# EAGLE design Lazerade_ChevronMCU (EAGLE 8.5.1)
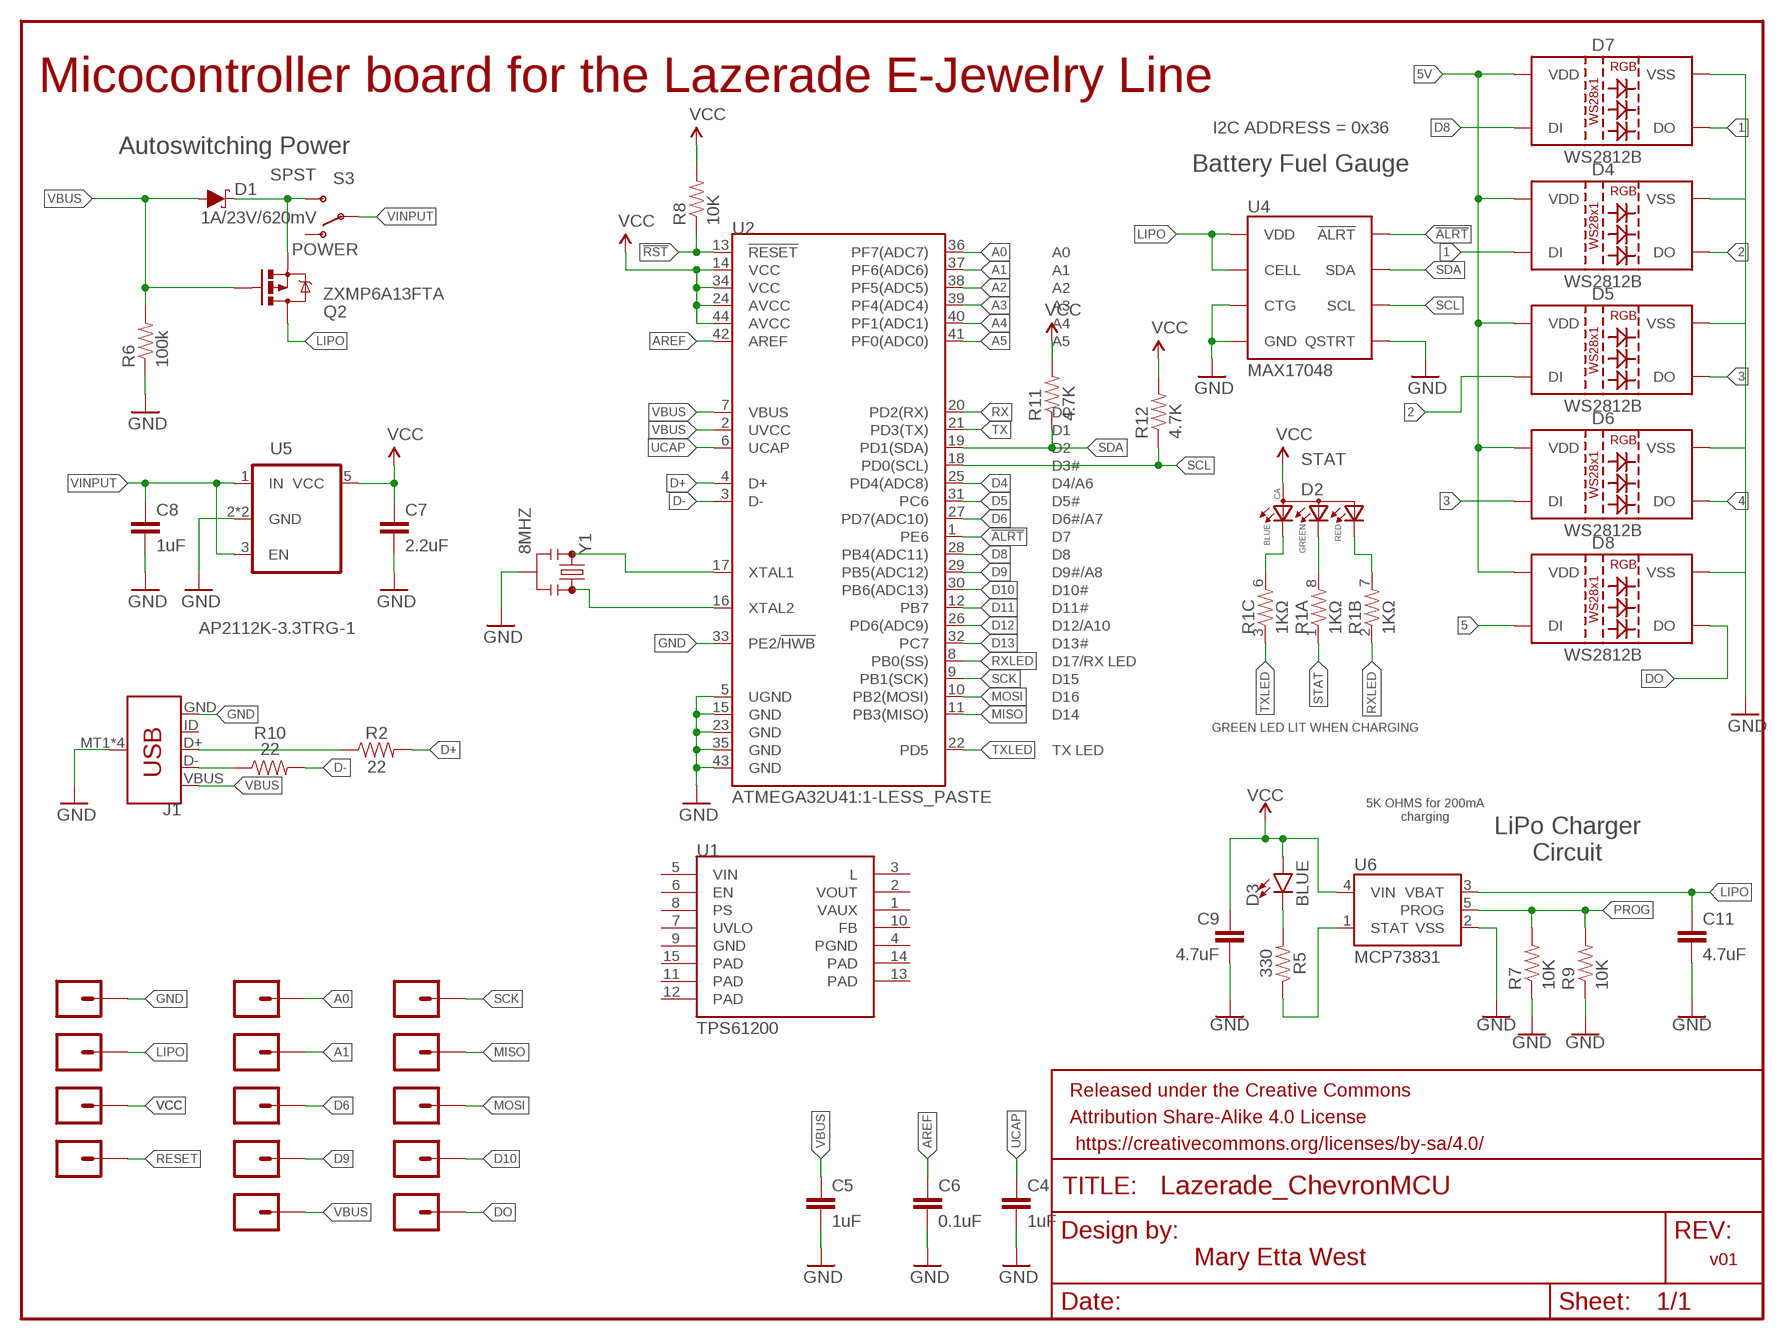
[diagram p0: schematic, sheet 1]

## Parts
C4  1uF  CAP0603-CAP  [0603-CAP]
C5  1uF  CAP0603-CAP  [0603-CAP]
C6  0.1uF  0.1UF-25V(+80/-20%)(0603)  [0603-CAP]
C7  2.2uF  2.2UF-10V-20%(0603)  [0603-CAP]
C8  1uF  CAP0603-CAP  [0603-CAP]
C9  4.7uF  4.7UF0603  [0603]
C11  4.7uF  4.7UF0603  [0603]
D1  1A/23V/620mV  DIODE-SCHOTTKY-BAT20J  [SOD-323]
D2  0.13_RGB_LEDPLCC  [P-LCC-4-3]
D3  BLUE  LED-BLUE0603  [LED-0603]
D4  WS2812B  [WS2812B]
D5  WS2812B  [WS2812B]
D6  WS2812B  [WS2812B]
D7  WS2812B  [WS2812B]
D8  WS2812B  [WS2812B]
FRAME1  FRAME-LETTER  [CREATIVE_COMMONS]
J1  USB_MICRO-B_SMT  [USB-MICROB]
Q2  ZXMP6A13FTA  MOSFET-PCHANNEL  [SOT23-3@1]
R1  1KΩ  RESISTOR-ARRAY0603-ARV  [0603-ARV]
R2  22  22OHM-0603-1/10W-1%  [0603]
R5  330  330OHM-0603-1/10W-1%  [0603]
R6  100k  100KOHM-1/10W-1%(0603)  [0603-RES]
R7  10K  10KOHM-1/10W-1%(0603)0603  [0603-RES]
R8  10K  10KOHM-1/10W-1%(0603)0603  [0603-RES]
R9  10K  10KOHM-1/10W-1%(0603)0603  [0603-RES]
R10  22  22OHM-0603-1/10W-1%  [0603]
R11  4.7K  RESISTOR0603-RES  [0603-RES]
R12  4.7K  RESISTOR0603-RES  [0603-RES]
S3  POWER  SWITCH-SPDT-SMD-A  [SWITCH-SPST-SMD-A]
U1  TPS61200  [QFN-10_PAD]
U2  ATMEGA32U41:1-LESS_PASTE  [QFN-44-NOPAD_1:1-LESS_PASTE]
U4  MAX17048  MAX17048DFN8  [DFN-8]
U5  AP2112K-3.3TRG-1  LDO-TPS78233  [SOT23-5]
U6  MCP73831  [SOT23-5]
U$1  LAZERADE_SINGLE_CONN  [SINLGE_PAD_CONNECT]
U$2  LAZERADE_SINGLE_CONN  [SINLGE_PAD_CONNECT]
U$3  LAZERADE_SINGLE_CONN  [SINLGE_PAD_CONNECT]
U$4  LAZERADE_SINGLE_CONN  [SINLGE_PAD_CONNECT]
U$5  LAZERADE_SINGLE_CONN  [SINLGE_PAD_CONNECT]
U$7  LAZERADE_SINGLE_CONN  [SINLGE_PAD_CONNECT]
U$8  LAZERADE_SINGLE_CONN  [SINLGE_PAD_CONNECT]
U$9  LAZERADE_SINGLE_CONN  [SINLGE_PAD_CONNECT]
U$10  LAZERADE_SINGLE_CONN  [SINLGE_PAD_CONNECT]
U$11  LAZERADE_SINGLE_CONN  [SINLGE_PAD_CONNECT]
U$12  LAZERADE_SINGLE_CONN  [SINLGE_PAD_CONNECT]
U$13  LAZERADE_SINGLE_CONN  [SINLGE_PAD_CONNECT]
U$14  LAZERADE_SINGLE_CONN  [SINLGE_PAD_CONNECT]
U$18  LAZERADE_SINGLE_CONN  [SINLGE_PAD_CONNECT]
Y1  8MHZ  RESONATOR8MHZ  [RESONATOR-SMD]

## Nets
1: D4.4(DI) D7.2(DO)
2: D4.2(DO) D5.4(DI)
3: D5.2(DO) D6.4(DI)
4: D6.2(DO)
5: D8.4(DI)
5V: D4.1(VDD) D5.1(VDD) D6.1(VDD) D7.1(VDD) D8.1(VDD)
!ALRT: U2.1(PE6) U4.P$5(!ALRT)
!RST: R8.1 U2.13(!RESET)
A0: U2.36(PF7(ADC7)) U$1.P$1
A1: U2.37(PF6(ADC6)) U$2.P$1
A2: U2.38(PF5(ADC5))
A3: U2.39(PF4(ADC4))
A4: U2.40(PF1(ADC1))
A5: U2.41(PF0(ADC0))
AREF: C6.1 U2.42(AREF)
D4: U2.25(PD4(ADC8))
D5: U2.31(PC6)
D6: U2.27(PD7(ADC10)) U$3.P$1
D8: D7.4(DI) U2.28(PB4(ADC11))
D9: U2.29(PB5(ADC12)) U$4.P$1
D10: U2.30(PB6(ADC13)) U$11.P$1
D11: U2.12(PB7)
D12: U2.26(PD6(ADC9))
D13: U2.32(PC7)
D+: R2.2 U2.4(D+)
D-: R10.2 U2.3(D-)
DO: D8.2(DO) U$18.P$1
GND [vcc]: C4.2 C5.2 C6.2 C7.2 C8.2 C9.2 C11.2 D4.3(VSS) D5.3(VSS) D6.3(VSS) D7.3(VSS) D8.3(VSS) J1.GND J1.MT1(SHIELD) J1.MT2(SHIELD) J1.P$1(SHIELD) J1.P$2(SHIELD) R6.1 R7.1 R9.1 U2.5(UGND) U2.15(GND) U2.23(GND) U2.33(PE2/!HWB) U2.35(GND) U2.43(GND) U4.P$1(CTG) U4.P$4(GND) U4.P$6(QSTRT) U4.P$9(GND) U5.2(GND) U5.4(GND) U6.2(VSS) U$13.P$1 Y1.2
INMOSFET: D1.C Q2.2(S) S3.3(S)
LIPO: C11.1 Q2.3(D) U4.P$2(CELL) U4.P$3(VDD) U6.3(VBAT) U$14.P$1
MISO: U2.11(PB3(MISO)) U$9.P$1
MOSI: U2.10(PB2(MOSI)) U$10.P$1
N$3: J1.D- R10.1
N$5: D2.3(BLUE) R1.6
N$6: D2.2(GREEN) R1.8
N$7: R5.1 U6.1(STAT)
N$8: D3.C R5.2
N$9: J1.D+ R2.1
N$34: D2.1(RED) R1.7
PROG: R7.2 R9.2 U6.5(PROG)
RESET: U$12.P$1
RX: U2.20(PD2(RX))
RXLED: R1.2 U2.8(PB0(SS))
SCK: U2.9(PB1(SCK)) U$8.P$1
SCL: R12.1 U2.18(PD0(SCL)) U4.P$7(SCL)
SDA: R11.1 U2.19(PD1(SDA)) U4.P$8(SDA)
STAT: R1.1
TX: U2.21(PD3(TX))
TXLED: R1.3 U2.22(PD5)
UCAP: C4.1 U2.6(UCAP)
VBUS: C5.1 D1.A J1.VBUS Q2.1(G) R6.2 U2.2(UVCC) U2.7(VBUS) U$5.P$1
VCC: C7.1 C9.1 D2.4(ANODE) D3.A R8.2 R11.2 R12.2 U2.14(VCC) U2.24(AVCC) U2.34(VCC) U2.44(AVCC) U5.5(VCC) U6.4(VIN) U$7.P$1
VINPUT: C8.1 S3.2(P) U5.1(IN) U5.3(EN)
X1: U2.17(XTAL1) Y1.3
X2: U2.16(XTAL2) Y1.1
Unconnected: J1.ID R1.4 R1.5 S3.1(O) U1.1(VAUX) U1.2(VOUT) U1.3(L) U1.4(PGND) U1.5(VIN) U1.6(EN) U1.7(UVLO) U1.8(PS) U1.9(GND) U1.10(FB) U1.11(PAD) U1.12(PAD) U1.13(PAD) U1.14(PAD) U1.15(PAD)

## Notes on the sheet
- Micocontroller board for the Lazerade E-Jewelry Line
- I2C ADDRESS = 0x36
- Autoswitching Power
- Battery Fuel Gauge
- SPST
- STAT
- GREEN LED LIT WHEN CHARGING
- 5K OHMS for 200mA
  charging
- LiPo Charger
  Circuit
- Mary Etta West | v01

## Library data of the parts
C4 C5 C8 = SparkFun-Passives:CAP: Capacitor Standard 0603 ceramic capacitor, and 0.1" leaded capacitor.; PROD_ID: CAP-00868
C6 = SparkFun-Capacitors:0.1UF-25V(+80/-20%)(0603): CAP-00810 Ceramic Standard decoupling cap; PROD_ID: CAP-00810
C7 = SparkFun-Capacitors:2.2UF-10V-20%(0603): CAP-07888; PROD_ID: CAP-07888
C9 C11 = SparkFun-Capacitors:4.7UF: 4.7µF ceramic capacitors A capacitor is a passive two-terminal electrical component used to store electrical energy temporarily in an electric field.; PROD_ID: CAP-08280
D1 = SparkFun-DiscreteSemi:DIODE-SCHOTTKY: Schottky diode A Schottky diode is a semiconductor diode which has a low forward voltage drop and a very fast switching action.; PROD_ID: DIO-11623
D2 = SparkFun-LED:0.13_RGB_LED: Everlight Red/Green/Blue LED 67-23/R6GHBHC-B01/2T || 67-23/R6GHBH-B01 Size 3.2*2.8*1.9mm Mounting Type SMD Full-Color LED PLCC4 Emitting Color Red/Green/Blue (620-625/530-535/470-475 nm) Chip Material AlGaInP/InGaN/InGaN Luminous Intensity 57-112/225-450/36-72 mcd Viewing Angle 120 deg Lens Type-Color Water Clear Forward Voltage 2.0/3.5/3.5 V Forward Current 10 mA Maximum Forward Voltage 2.4/3.9/3.9 V Maximum Forward Current 25/25/25 mA Min-Max Operating Temperature -40C to +85C Factory Pack 2000 pcs-Reel RoHS ✓; PROD_ID: DIO-12986
D3 = SparkFun-LED:LED-BLUE: Blue SMD LED Used in manufacturing of various products at SparkFun Packages: 0603 - SMD 0603 package [Product Link] <http://www.digikey.com/product-detail/en/SMLE12BC7TT86/511-1589-2-ND/1641808> 1206 - SMD1206 package [Product Link] <http://www.digikey.com/product-detail/en/lite-on-inc/LTST-C150TBKT/160-1643-1-ND/573584> SparkFun Products: ESP8266 Thing-Dev Board <https://www.sparkfun.com/products/13711> RedBoard <https://www.sparkfun.com/products/12757>; PROD_ID: DIO-08575
D4-D8 = SparkFun-LED:WS2812B: WS2812B SMD addressable RGB LED 5x5mm SMD LED with built-in controller IC. Color: Red/Green/Blue mC Rating: RGB: 390, 660, 180 mcd Forward Voltage: RGB: 2.0, 3.0, 3.0 V Packages:WS2812B SparkFun Products: Blynk Board - ESP8266 <https://www.sparkfun.com/products/13794>; PROD_ID: DIO-12503
FRAME1 = SparkFun-Aesthetics:FRAME-LETTER: Schematic Frame - Letter Standard 8.5x11 US Letter frame
J1 = SparkFun-Connectors:USB_MICRO-B: USB Type Micro-B Connector Male/female and PTH/SMT variants SparkFun Products: SparkFun microB USB Breakout <https://www.sparkfun.com/products/12035> SparkFun USB microB Plug Breakout <https://www.sparkfun.com/products/10031> SparkFun ESP8266 Thing <https://www.sparkfun.com/products/13231>; PROD_ID: CONN-09505; SF_ID: PRT-08533
Q2 = SparkFun-DiscreteSemi:MOSFET-PCHANNEL: Generic PMOSFET IRLML2244 - TRANS-11153 (SOT-23 -20V -4.3A) (1.Gate 2.Source 3.Drain) FQP27P06 - COM-10349 <http://www.sparkfun.com/products/10349> (TO-220 -60V -27A) (1.Gate 2.Source 3.Drain); PROD_ID: TRANS-08285
R1 = SparkFun-Passives:RESISTOR-ARRAY: Array Chip Resistor Source: RS Component / Phycomp; PROD_ID: RES-12985
R2 R10 = SparkFun-Resistors:22OHM: 22Ω resistor A resistor is a passive two-terminal electrical component that implements electrical resistance as a circuit element. Resistors act to reduce current flow, and, at the same time, act to lower voltage levels within circuits. - Wikipedia; PROD_ID: RES-08698
R5 = SparkFun-Resistors:330OHM: 330Ω resistor A resistor is a passive two-terminal electrical component that implements electrical resistance as a circuit element. Resistors act to reduce current flow, and, at the same time, act to lower voltage levels within circuits. - Wikipedia; PROD_ID: RES-00818
R6 = SparkFun-Resistors:100KOHM-1/10W-1%(0603): RES-07828; PROD_ID: RES-07828
R7-R9 = SparkFun-Resistors:10KOHM-1/10W-1%(0603): RES-00824; PROD_ID: RES-00824
R11 R12 = SparkFun-Passives:RESISTOR: Resistor Basic schematic elements and footprints for 0603, 1206, and PTH resistors.; PROD_ID: RES-07857
S3 = SparkFun-Electromechanical:SWITCH-SPDT: SPDT Switch Simple slide switch, Spark Fun Electronics SKU : COM-00102 DPDT SMT slide switch, AYZ0202, SWCH-08179; PROD_ID: SWCH-10651
U1 = SparkFun-IC-Power:TPS61200: DC to DC Booster IC-10035; PROD_ID: IC-10035
U2 = SparkFun-DigitalIC:ATMEGA32U4: Atmel 44-pin 8-bit Microcontroller with 32KBytes of ISP Flash and USB Controller; PROD_ID: IC-10828
U4 = SparkFun-DigitalIC:MAX17048: Micropower 1-Cell Li+ ModelGauge; PROD_ID: IC-12551
U5 = SparkFun-PowerIC:LDO-TPS78233: Voltage Regulator LDO 500nA Ground Current, 150mA, Ultra-Low Quiescent Current Low-Dropout Linear Regulator.; PROD_ID: VREG-12457
U6 = SparkFun-IC-Power:MCP73831: MCP73831T Li-Ion, Li-Pol Controller Miniature single cell, fully integrated Li-Ion, Li-polymer charge management controller Datasheet <http://ww1.microchip.com/downloads/en/DeviceDoc/20001984g.pdf> SparkFun Products: SparkFun ESP32 Thing <https://www.sparkfun.com/products/13907> SparkFun 9DoF Razor IMU M0 <https://www.sparkfun.com/products/14001>; PROD_ID: IC-09995
U$1-U$5 U$7-U$14 U$18 = Lazerade_Connectors:LAZERADE_SINGLE_CONN
Y1 = SparkFun-FreqCtrl:RESONATOR: Resonator Small SMD resonator. Used, eg, on the Arduino Pro/ Pro Mini boards. 8MHz- XTAL-08895 16MHz- XTAL-08900; PROD_ID: XTAL-08895

## Net classes
0 default: width 0.203 mm
1 vcc: width 0.254 mm

## Board
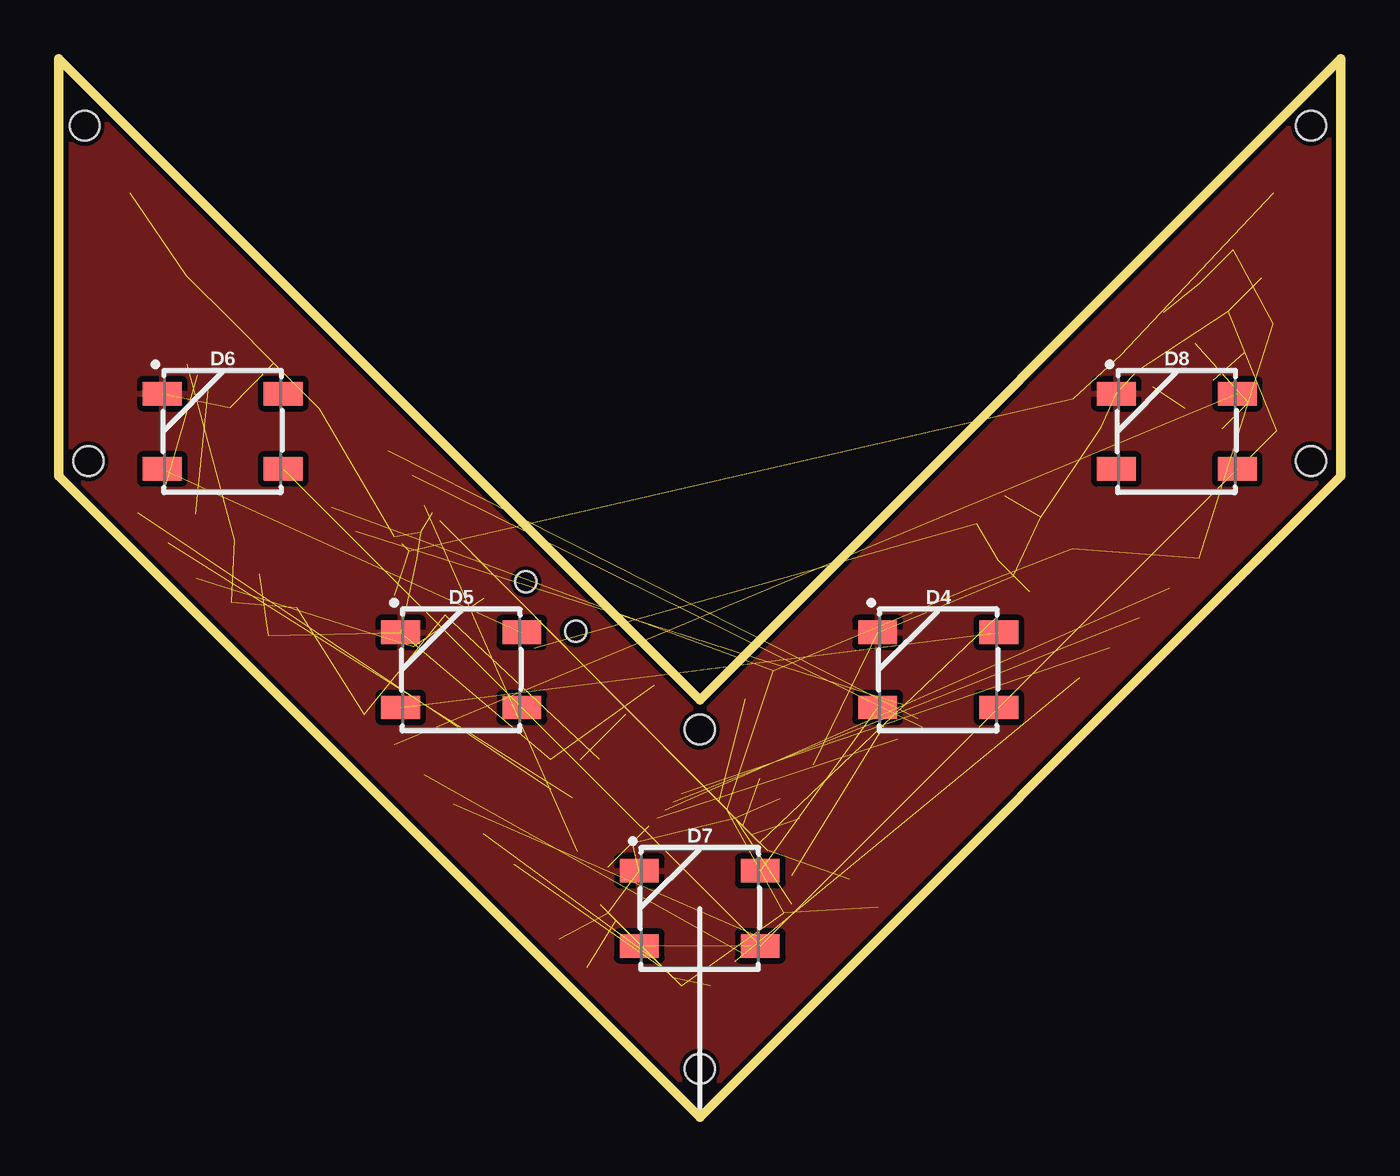
[diagram p1: board, top side]
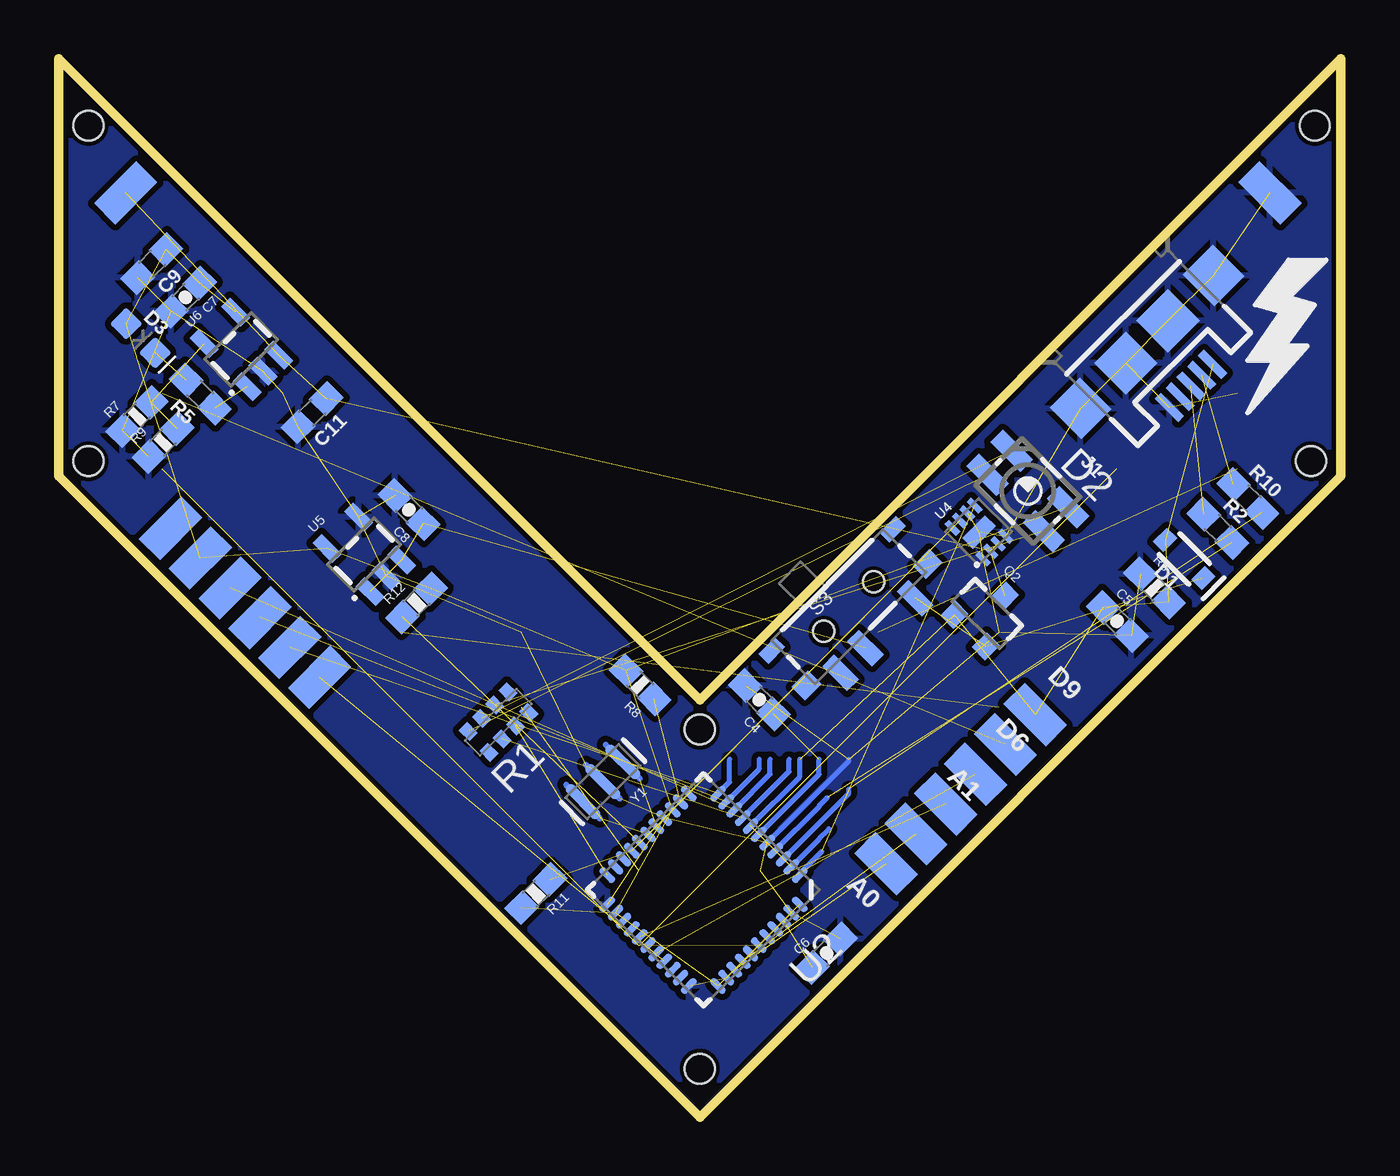
[diagram p2: board, bottom side, seen from below]

Size 54.61 x 45.09 mm. Coordinates in mm from the lower left corner, seen from the top.
Outline: 0,45.09 0,27.3 27.3,0 54.61,27.3 54.61,45.09 27.3,17.78 0,45.09
Copper layers (1*16): Top 0.035mm / dielectric 0.15mm / Bottom 0.035mm
Design rules "SparkFun-2-layer-STANDARD *": minimum track width 10mil, minimum drill 20mil, track to track 10mil, track to pad 8mil, pad to pad 8mil, via to via 10mil, smd to smd 8mil, copper to edge 8mil, drill to drill 8mil, minimum pad ring 10mil, minimum via ring 10mil, stop-mask expansion 4mil, vias tented up to drill 25mil, thermal gap 10mil
Holes 1.27 mm at 1.11,42.23 1.27,27.94 53.34,27.94 53.34,42.23 27.3,2.06 27.3,16.51

### Footprints (pad centres in the part's own frame; a part is rotated, then mirrored left to right if it is on the bottom)
0603-CAP = smd 1.1 x 1: 1 -0.85,0; 2 0.85,0
0603 = smd 1.1 x 1: 1 -0.85,0; 2 0.85,0
SOD-323 = smd 0.63 x 0.83: A 1.15,0; C -1.15,0
P-LCC-4-3 = smd 0.75 x 1.8: 1 0.725,1.7; 2 -0.725,1.7; 3 -0.725,-1.7; 4 0.725,-1.7
LED-0603 = smd 1 x 1: A -0.877,0; C 0.877,0
WS2812B = smd 1.651 x 1: 1 2.577,-1.6; 2 2.577,1.6; 3 -2.577,1.6; 4 -2.577,-1.6
USB-MICROB = smd 1.4 x 0.35: D+ -2.65,0; D- -2.65,-0.65; GND -2.65,1.3; ID -2.65,0.65; VBUS -2.65,-1.3 | smd 1.9 x 1.8: MT1 0,-4; MT2 0,4 | smd 1.9 x 1.9: P$1 0,-1.27; P$2 0,1.27
SOT23-3@1 = smd 0.8 x 0.9: 1 -0.95,-1; 2 0.95,-1; 3 0,1.1
0603-ARV = smd 0.5 x 0.65: 1 -1.2,-0.625; 2 -0.4,-0.625; 3 0.4,-0.625; 4 1.2,-0.625; 5 1.2,0.625; 6 0.4,0.625; 7 -0.4,0.625; 8 -1.2,0.625
0603-RES = smd 1.1 x 1: 1 -0.85,0; 2 0.85,0
SWITCH-SPST-SMD-A = smd 0.7 x 1.5: 1 -2.25,-1.75; 2 -0.75,-1.75; 3 2.25,-1.75 | smd 1 x 0.6: GND1 -3.65,1; GND3 3.65,1 | smd 1 x 0.8: GND2 -3.65,-1.1; GND4 3.65,-1.1 | hole 0.9: -1.5,0; 1.5,0
QFN-10_PAD = smd 0.297 x 0.85: 1 -1,-1.475; 2 -0.5,-1.475; 3 0,-1.475; 4 0.5,-1.475; 5 1,-1.475; 6 1,1.475; 7 0.5,1.475; 8 0,1.475; 9 -0.5,1.475; 10 -1,1.475 | smd 0.7 x 0.28: 11 -1.5,0.25; 12 -1.5,-0.25; 13 1.5,0.25; 14 1.5,-0.25 | smd 2.4 x 1.65: 15 0,0
QFN-44-NOPAD_1:1-LESS_PASTE = smd 0.8 x 0.3: 1 -3.337,2.458; 2 -3.337,1.958; 3 -3.337,1.479; 4 -3.337,0.979; 5 -3.337,0.5; 6 -3.337,0; 7 -3.337,-0.5; 8 -3.337,-0.979; 9 -3.337,-1.479; 10 -3.337,-1.958; 11 -3.337,-2.458; 23 3.337,-2.458; 24 3.337,-1.958; 25 3.337,-1.479; 26 3.337,-0.979; 27 3.337,-0.5; 28 3.337,0; 29 3.337,0.5; 30 3.337,0.979; 31 3.337,1.479; 32 3.337,1.958; 33 3.337,2.458 | smd 0.3 x 0.8: 12 -2.458,-3.337; 13 -1.958,-3.337; 14 -1.479,-3.337; 15 -0.979,-3.337; 16 -0.5,-3.337; 17 0,-3.337; 18 0.5,-3.337; 19 0.979,-3.337; 20 1.479,-3.337; 21 1.958,-3.337; 22 2.458,-3.337; 34 2.458,3.337; 35 1.958,3.337; 36 1.479,3.337; 37 0.979,3.337; 38 0.5,3.337; 39 0,3.337; 40 -0.5,3.337; 41 -0.979,3.337; 42 -1.479,3.337; 43 -1.958,3.337; 44 -2.458,3.337
DFN-8 = smd 0.25 x 0.7: P$1 -0.688,-0.92; P$2 -0.238,-0.92; P$3 0.212,-0.92; P$4 0.662,-0.92; P$5 0.662,0.93; P$6 0.212,0.93; P$7 -0.238,0.93; P$8 -0.688,0.93 | smd 1.37 x 0.64: P$9 -0.013,0.005
SOT23-5 = smd 0.55 x 1.2: 1 -0.95,-1.3; 2 0,-1.3; 3 0.95,-1.3; 4 0.95,1.3; 5 -0.95,1.3
SINLGE_PAD_CONNECT = smd 2.54 x 1.27: P$1 0,0
RESONATOR-SMD = smd 0.45 x 1.905: 1 -1.2,0; 2 0,0; 3 1.2,0

### Placement (x,y rotation side)
C4  24.77,17.78 135 bottom
C5  9.53,21.11 315 bottom
C6  21.91,6.99 45 bottom
C7  49.21,34.92 225 bottom
C8  39.69,25.88 135 bottom
C9  50.64,36.35 225 bottom
C11  43.81,30 225 bottom
D1  6.67,23.77 135 bottom
D2  13.33,26.67 45 bottom
D3  51.12,33.18 315 bottom
D4  37.47,19.05 0 top
D5  17.14,19.05 0 top
D6  6.99,29.21 0 top
D7  27.3,8.89 0 top
D8  47.62,29.21 0 top
FRAME1  -3.17,-17.46 0 top  (outside the outline)
J1  8.25,33.02 135 bottom
Q2  15.08,21.43 315 bottom
R1  35.88,16.83 45 bottom
R2  5.24,25.08 315 bottom
R5  48.58,30.8 135 bottom
R6  7.94,22.54 315 bottom
R7  51.28,29.84 45 bottom
R8  29.85,18.41 135 bottom
R9  50.16,28.73 45 bottom
R10  3.97,26.35 315 bottom
R11  34.29,9.53 225 bottom
R12  39.37,21.91 45 bottom
S3  20.96,21.75 45 bottom
U1  -20,-21.43 0 top  (outside the outline)
U2  27.15,9.68 225 bottom
U4  15.4,24.92 45 bottom
U5  41.59,23.97 45 bottom
U6  46.83,32.7 45 bottom
U$1  19.37,10.8 315 bottom
U$2  18.1,12.07 315 bottom
U$3  16.83,13.34 315 bottom
U$4  15.56,14.61 315 bottom
U$5  13.02,17.14 315 bottom
U$7  48.58,23.81 45 bottom
U$8  47.31,22.54 45 bottom
U$9  44.77,20 45 bottom
U$10  46.04,21.27 45 bottom
U$11  43.5,18.73 45 bottom
U$12  49.85,25.08 45 bottom
U$13  3.02,39.37 315 bottom
U$14  51.75,39.37 45 bottom
U$18  14.29,15.88 315 bottom
Y1  31.43,14.29 225 bottom

### Tracks (layer width: path | path; a pad name or v marks a point on that pad's centre or on a via)
1  (1 unrouted)
2  (1 unrouted)
3  (1 unrouted)
5V  (4 unrouted)
!ALRT  (2 unrouted)
  Bottom 0.203: U2.1 23.05,10.37 22.11,11.31
!RST  (1 unrouted)
A0  (1 unrouted)
A1  (1 unrouted)
AREF  (1 unrouted)
D6  (1 unrouted)
D8  (1 unrouted)
D9  (1 unrouted)
D10  (1 unrouted)
D+  (2 unrouted)
  Bottom 0.203: U2.4 22.23,13.22 22.23,13.25 21.87,13.61
D-  (2 unrouted)
  Bottom 0.203: U2.3 20.96,13.78 20.96,13.97
DO  (1 unrouted)
GND  (35 unrouted)
  Bottom 0.203: U2.5 20.96,15.17 20.96,15.24
  pour Top: 0,45.09 0,27.3 27.3,0 54.61,27.3 54.61,45.09 27.3,17.78
  pour Bottom: 0,45.09 0,27.3 27.3,0 54.61,27.3 54.61,45.09 27.3,17.78
INMOSFET  (2 unrouted)
LIPO  (5 unrouted)
MISO  (2 unrouted)
  Bottom 0.203: U2.11 26.04,14.27 26.04,15.24
MOSI  (2 unrouted)
  Bottom 0.203: U2.10 24.77,14.83 24.77,15.24
N$3  (1 unrouted)
N$5  (1 unrouted)
N$6  (1 unrouted)
N$7  (1 unrouted)
N$8  (1 unrouted)
N$9  (1 unrouted)
N$34  (1 unrouted)
PROG  (2 unrouted)
RXLED  (2 unrouted)
  Bottom 0.203: U2.8 23.5,14.72 23.5,15.24
SCK  (2 unrouted)
  Bottom 0.203: U2.9 24.31,14.61 24.31,15.24
SCL  (2 unrouted)
SDA  (2 unrouted)
TXLED  (1 unrouted)
UCAP  (2 unrouted)
  Bottom 0.203: U2.6 22.23,14.61 22.23,15.24
VBUS  (9 unrouted)
  Bottom 0.203: U2.7 23.04,14.5 23.04,15.24 | U2.2 22.23,11.84 22.23,11.87 21.81,12.28
VCC  (13 unrouted)
VINPUT  (3 unrouted)
X1  (1 unrouted)
X2  (1 unrouted)

### Text on the board
bPlace: D9 | D6 | A1 | A0